# EAGLE design low-energy-meter (EAGLE 7.2.0)
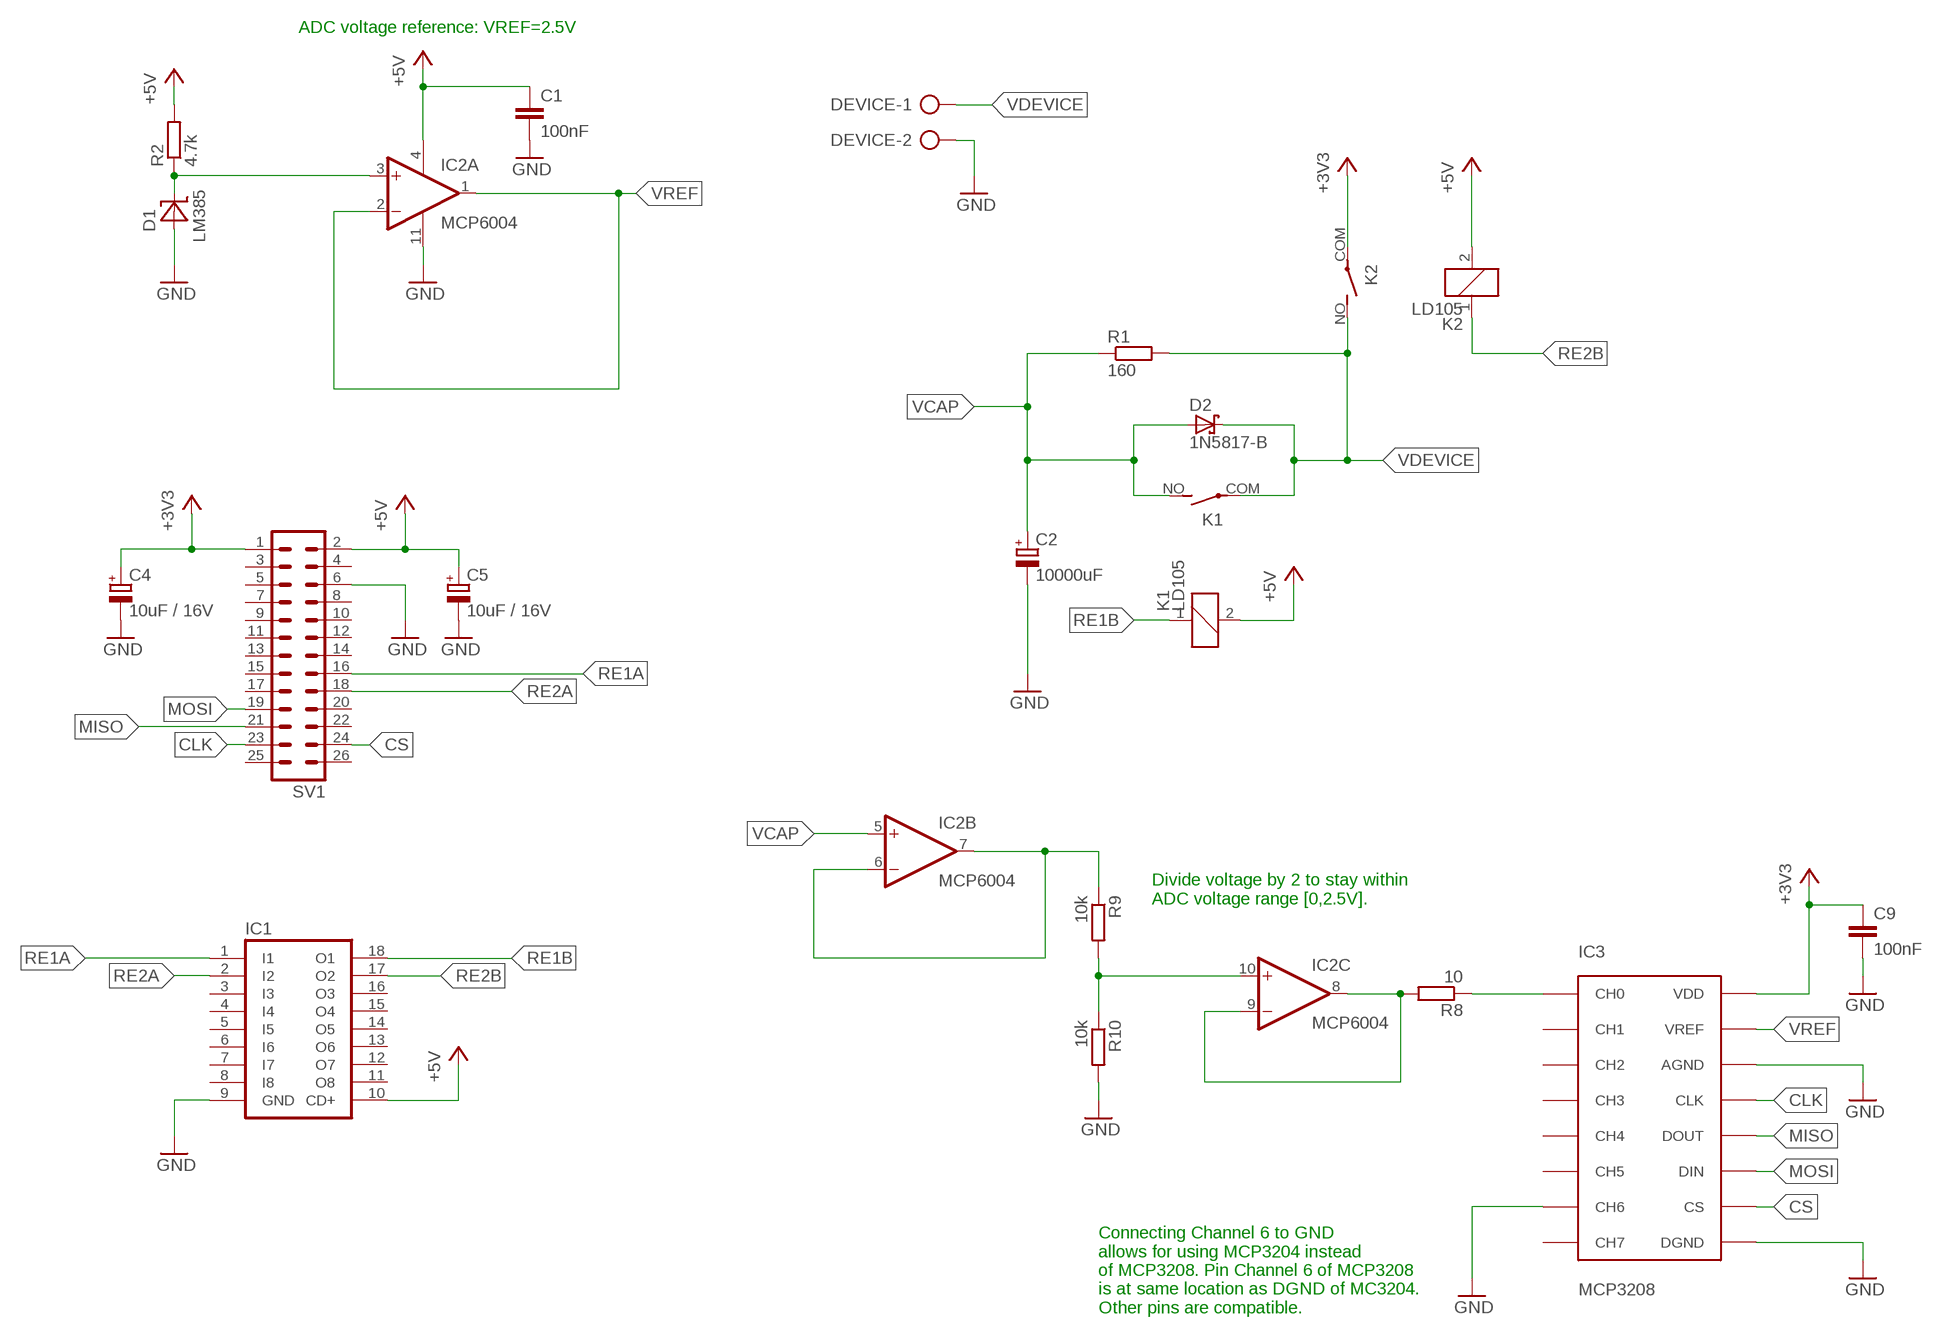
[diagram p0: schematic, sheet 1]

## Parts
C1  100nF  C-EU050-024X044  [C050-024X044]
C2  10000uF  CPOL-EUE7.5-18  [E7,5-18]
C4  10uF / 16V  CPOL-EUE2.5-6  [E2,5-6]
C5  10uF / 16V  CPOL-EUE2.5-6  [E2,5-6]
C9  100nF  C-EU050-024X044  [C050-024X044]
D1  LM385  [TO-92]
D2  1N5817-B  [DO41-7.6]
DEVICE  AK500/2  [AK500/2]
IC1  ULN2803A  [DIL18]
IC2  MCP6004  LM324N  [DIL14]
IC3  MCP3208  [DIL16]
K1  LD105  [LD]
K2  LD105  [LD]
R1  160  R-EU_0207/7  [0207/7]
R2  4.7k  R-EU_0207/7  [0207/7]
R8  10  R-EU_0207/7  [0207/7]
R9  10k  R-EU_0207/7  [0207/7]
R10  10k  R-EU_0207/7  [0207/7]
SV1  ML26  [ML26]

## Nets
+3V3: C4.+ C9.1 IC3.VDD K2.COM(2:P) SV1.1
+5V: C1.1 C5.+ IC1.10(CD+) IC2.4(P:V+) K1.2 K2.2 R2.2 SV1.2
CLK: IC3.CLK SV1.23
CS: IC3.CS SV1.24
GND: C1.2 C2.- C4.- C5.- C9.2 D1.+ DEVICE.2 IC1.9(GND) IC2.11(P:V-) IC3.AGND IC3.CH6 IC3.DGND R10.2 SV1.6
MISO: IC3.DOUT SV1.21
MOSI: IC3.DIN SV1.19
N$1: IC2.6(B:-IN) IC2.7(B:OUT) R9.1
N$9: IC2.10(C:+IN) R9.2 R10.1
N$10: IC3.CH0 R8.1
N$13: IC2.8(C:OUT) IC2.9(C:-IN) R8.2
N$14: D1.- IC2.3(A:+IN) R2.1
RE1A: IC1.1(I1) SV1.16
RE1B: IC1.18(O1) K1.1
RE2A: IC1.2(I2) SV1.18
RE2B: IC1.17(O2) K2.1
VCAP: C2.+ D2.A IC2.5(B:+IN) K1.NO(2:S) R1.1
VDEVICE: D2.C DEVICE.1 K1.COM(2:P) K2.NO(2:S) R1.2
VREF: IC2.1(A:OUT) IC2.2(A:-IN) IC3.VREF
Unconnected: IC1.3(I3) IC1.4(I4) IC1.5(I5) IC1.6(I6) IC1.7(I7) IC1.8(I8) IC1.11(O8) IC1.12(O7) IC1.13(O6) IC1.14(O5) IC1.15(O4) IC1.16(O3) IC2.12(D:+IN) IC2.13(D:-IN) IC2.14(D:OUT) IC3.CH1 IC3.CH2 IC3.CH3 IC3.CH4 IC3.CH5 IC3.CH7 SV1.3 SV1.4 SV1.5 SV1.7 SV1.8 SV1.9 SV1.10 SV1.11 SV1.12 SV1.13 SV1.14 SV1.15 SV1.17 SV1.20 SV1.22 SV1.25 SV1.26

## Notes on the sheet
- ADC voltage reference: VREF=2.5V
- Divide voltage by 2 to stay within
  ADC voltage range [0,2.5V].
- Connecting Channel 6 to GND 
  allows for using MCP3204 instead 
  of MCP3208. Pin Channel 6 of MCP3208 
  is at same location as DGND of MC3204. 
  Other pins are compatible.

## Library data of the parts
C1 C9 = rcl:C-EU: CAPACITOR, European symbol
C2 C4 C5 = rcl:CPOL-EU: POLARIZED CAPACITOR, European symbol
D1 = lm385:LM385: LM385 LM385 Micropower Voltage Reference
D2 = diode:1N581*: 1.0A SCHOTTKY BARRIER RECTIFIER Source: http://www.diodes.com/datasheets/ds23001.pdf
DEVICE = con-ptr500:AK500/2: CONNECTOR; OC_FARNELL: unknown; OC_NEWARK: unknown
IC1 = uln-udn:ULN2803A: DRIVER ARRAY
IC2 = linear:LM324: OP AMP
IC3 = mcp3208:MCP3208
K1 K2 = relay:LD?*: Slim Power Relay NAiS Source: http://www.mew-europe.com/.. en_ds_61112_0000.pdf; OC_FARNELL: 3727154; OC_NEWARK: unknown
R1 R2 R8-R10 = rcl:R-EU_: RESISTOR, European symbol
SV1 = con-harting-ml:ML26: HARTING; OC_FARNELL: unknown; OC_NEWARK: unknown

## Board
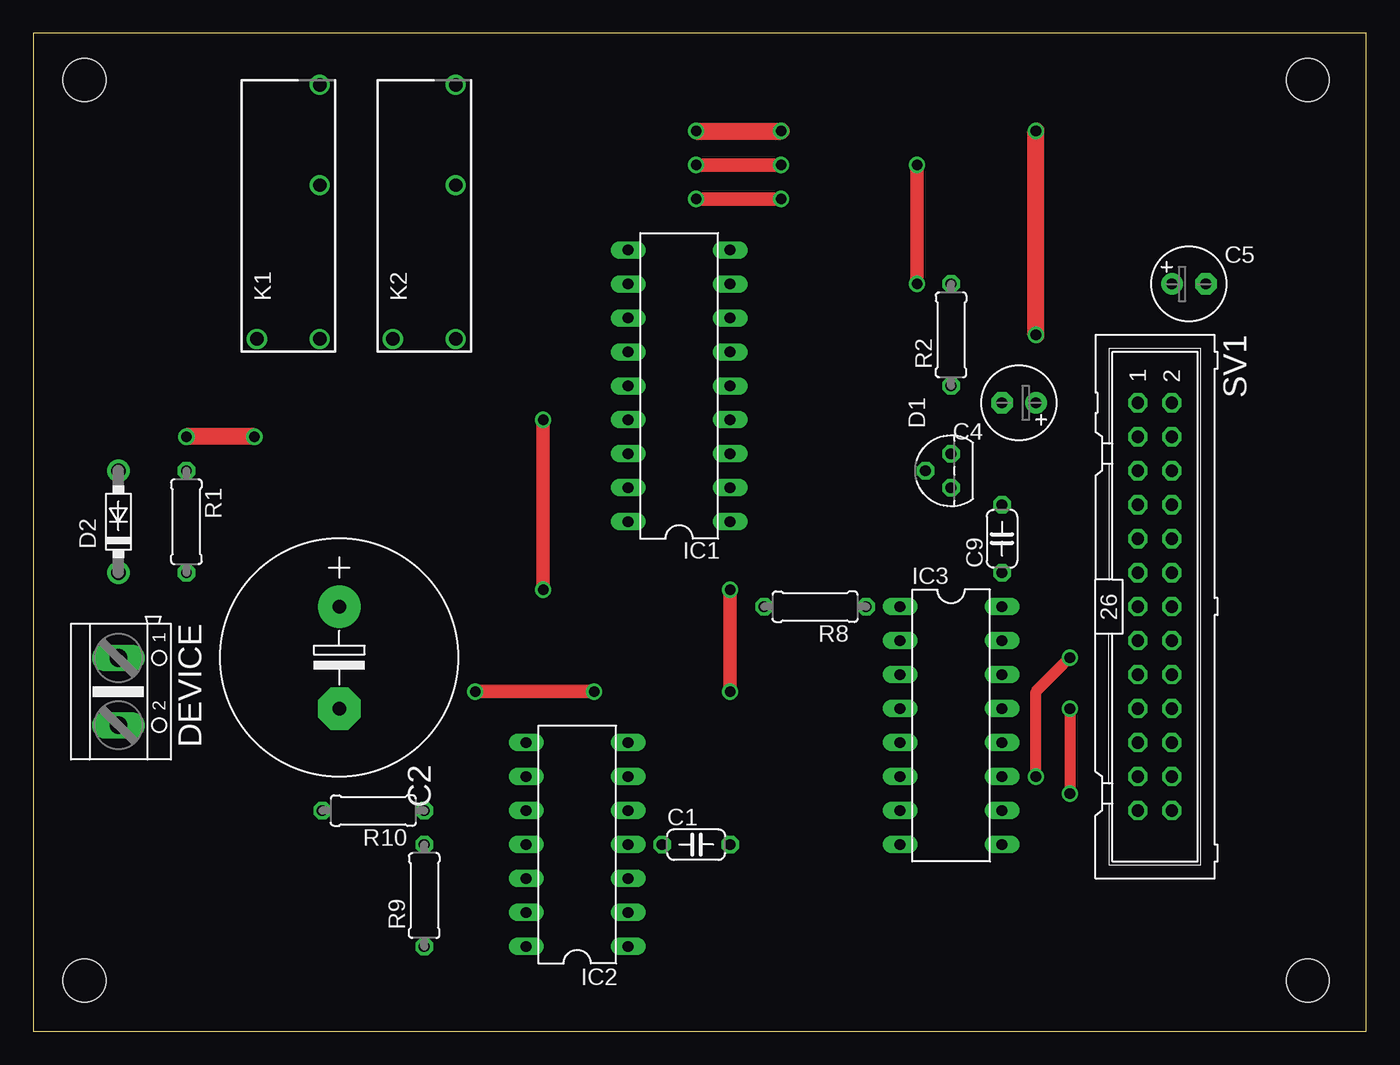
[diagram p1: board, top side]
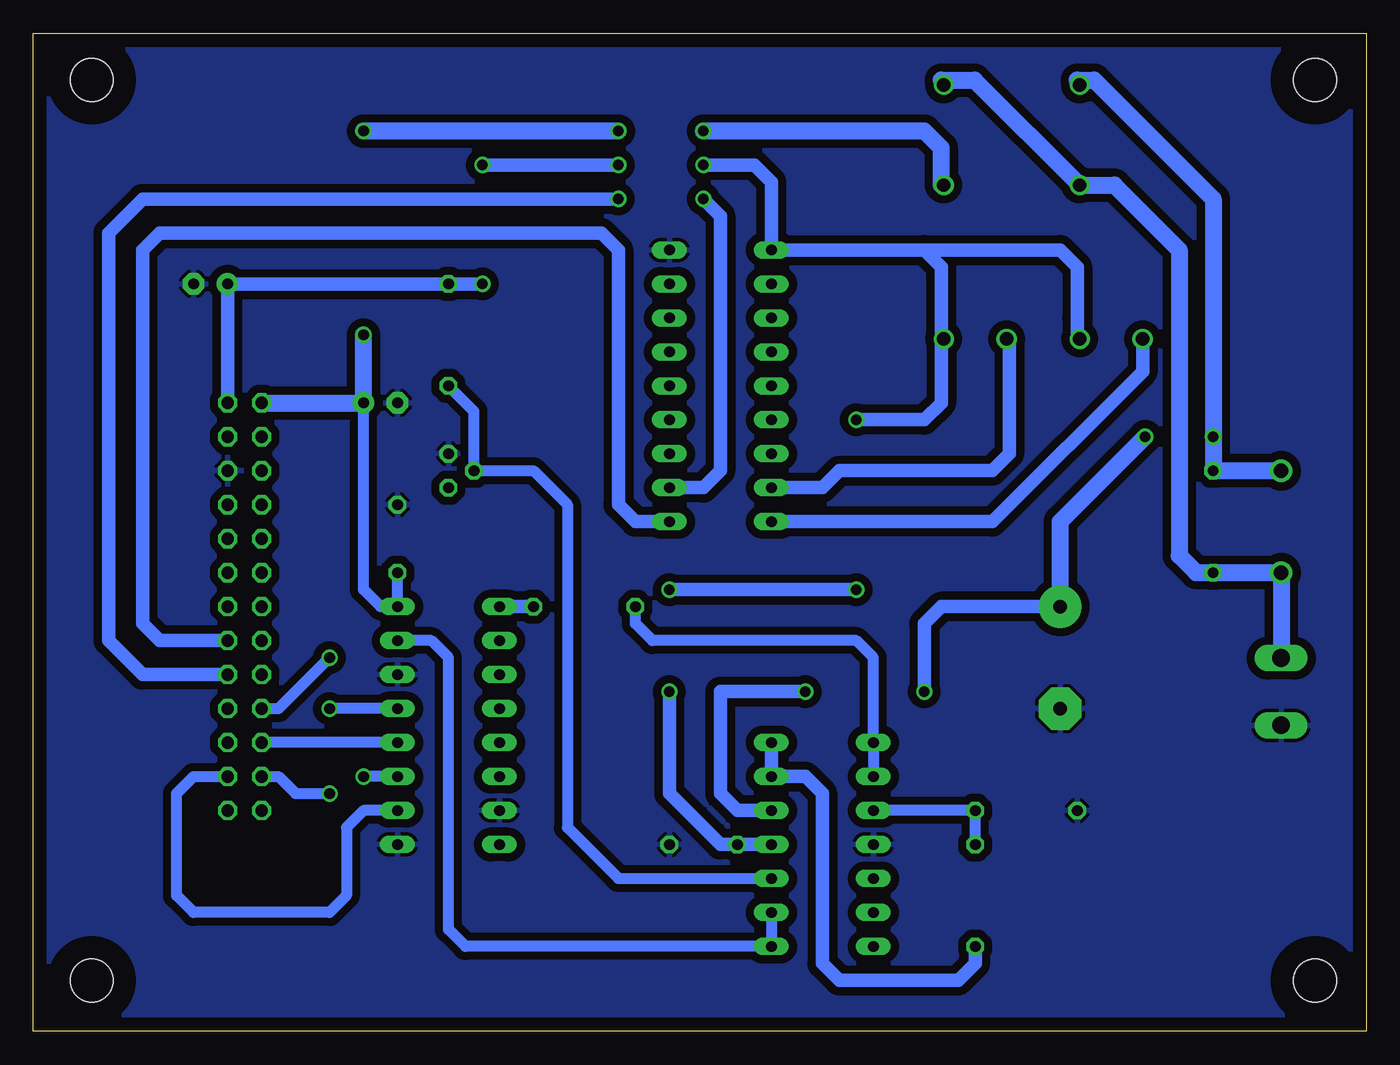
[diagram p2: board, bottom side, seen from below]

Size 99.6 x 74.6 mm. Coordinates in mm from the lower left corner, seen from the top.
Outline: 0,0 99.6,0 99.6,74.6 0,74.6 0,0
Copper layers (1*16): Top 0.035mm / dielectric 1.5mm / Bottom 0.035mm
Design rules "default *": minimum track width 10mil, minimum drill 24mil, track to track 24mil, track to pad 24mil, pad to pad 24mil, via to via 24mil, smd to smd 8mil, copper to edge 40mil, drill to drill 8mil, minimum pad ring 10mil, minimum via ring 8mil, stop-mask expansion 4mil, vias tented up to drill 0mil, thermal gap 10mil
Holes 3.2 mm at 3.81,3.81 3.81,71.12 95.25,3.81 95.25,71.12
bRestrict: area 92,0.5 to 98.5,7.1; area 0.5,0.5 to 7.1,7.1; area 0.5,67.8 to 7.1,74.4; area 92,67.8 to 98.5,74.4

### Footprints (pad centres in the part's own frame; a part is rotated, then mirrored left to right if it is on the bottom)
C050-024X044 = drill 0.813 octagon: 1 -2.54,0; 2 2.54,0
E7,5-18 = drill 1.016 pad 3.15: + -3.81,0 | drill 1.016 pad 3.15 octagon: - 3.81,0
E2,5-6 = drill 0.813 pad 1.6: + -1.27,0 | drill 0.813 pad 1.6 octagon: - 1.27,0
TO-92 = drill 0.813 octagon: + 1.27,0; - 0,1.905; NC -1.27,0
DO41-7.6 = drill 1.1 pad 1.7: A 3.81,0; C -3.81,0
AK500/2 = drill 1.321 long: 1 -2.515,0; 2 2.515,0
DIL18 = drill 0.813 long: 1 -10.16,-3.81; 2 -7.62,-3.81; 3 -5.08,-3.81; 4 -2.54,-3.81; 5 0,-3.81; 6 2.54,-3.81; 7 5.08,-3.81; 8 7.62,-3.81; 9 10.16,-3.81; 10 10.16,3.81; 11 7.62,3.81; 12 5.08,3.81; 13 2.54,3.81; 14 0,3.81; 15 -2.54,3.81; 16 -5.08,3.81; 17 -7.62,3.81; 18 -10.16,3.81
DIL14 = drill 0.813 long: 1 -7.62,-3.81; 2 -5.08,-3.81; 3 -2.54,-3.81; 4 0,-3.81; 5 2.54,-3.81; 6 5.08,-3.81; 7 7.62,-3.81; 8 7.62,3.81; 9 5.08,3.81; 10 2.54,3.81; 11 0,3.81; 12 -2.54,3.81; 13 -5.08,3.81; 14 -7.62,3.81
DIL16 = drill 0.813 long: AGND -3.81,3.81; CH0 -8.89,-3.81; CH1 -6.35,-3.81; CH2 -3.81,-3.81; CH3 -1.27,-3.81; CH4 1.27,-3.81; CH5 3.81,-3.81; CH6 6.35,-3.81; CH7 8.89,-3.81; CLK -1.27,3.81; CS 6.35,3.81; DGND 8.89,3.81; DIN 3.81,3.81; DOUT 1.27,3.81; VDD -8.89,3.81; VREF -6.35,3.81
LD = drill 1: 1 -9.2,2.35; 2 -9.2,-2.35; COM 2.3,-2.35; NO 9.8,-2.35
0207/7 = drill 0.813 octagon: 1 -3.81,0; 2 3.81,0
ML26 = drill 0.914 octagon: 1 -15.24,-1.27; 2 -15.24,1.27; 3 -12.7,-1.27; 4 -12.7,1.27; 5 -10.16,-1.27; 6 -10.16,1.27; 7 -7.62,-1.27; 8 -7.62,1.27; 9 -5.08,-1.27; 10 -5.08,1.27; 11 -2.54,-1.27; 12 -2.54,1.27; 13 0,-1.27; 14 0,1.27; 15 2.54,-1.27; 16 2.54,1.27; 17 5.08,-1.27; 18 5.08,1.27; 19 7.62,-1.27; 20 7.62,1.27; 21 10.16,-1.27; 22 10.16,1.27; 23 12.7,-1.27; 24 12.7,1.27; 25 15.24,-1.27; 26 15.24,1.27

### Placement (x,y rotation side)
C1  49.53,13.97 0 top
C2  22.86,27.94 270 top
C4  73.66,46.99 180 top
C5  86.36,55.88 0 top
C9  72.39,36.83 90 top
D1  68.58,41.91 90 top
D2  6.35,38.1 90 top
DEVICE  6.35,25.4 270 top
IC1  48.26,48.26 90 top
IC2  40.64,13.97 90 top
IC3  68.58,22.86 270 top
K1  19.05,60.96 90 top
K2  29.21,60.96 90 top
R1  11.43,38.1 270 top
R2  68.58,52.07 90 top
R8  58.42,31.75 180 top
R9  29.21,10.16 90 top
R10  25.4,16.51 180 top
SV1  83.82,31.75 270 top

### Tracks (layer width: path | path; a pad name or v marks a point on that pad's centre or on a via)
+3V3  (via drill 0.8)
  Top 1.27: v74.93,52.07 v74.93,67.31 | v49.53,67.31 v55.88,67.31
  Bottom 0.813: C9.1 IC3.VDD 73.66,31.75 74.93,33.02 C4.+
  Bottom 1.016: K2.COM 31.75,63.26
  Bottom 1.27: SV1.1 C4.+ v74.93,52.07 | 31.75,63.26 31.75,66.04 33.02,67.31 v49.53,67.31 | v55.88,67.31 v74.93,67.31
+5V  (via drill 0.8)
  Top 1.016: v66.04,55.88 v66.04,64.77 | v55.88,64.77 v49.53,64.77 | v38.1,33.02 v38.1,45.72 | v52.07,25.4 v52.07,33.02
  Bottom 1.016: SV1.2 C5.+ R2.2 v66.04,55.88 | IC2.4 C1.1 48.26,13.97 52.07,17.78 v52.07,25.4 | v66.04,64.77 v55.88,64.77 | v49.53,64.77 45.72,64.77 44.45,63.5 IC1.10 33.02,58.42 | 33.02,58.42 31.75,57.15 31.75,51.76 | 33.02,58.42 22.86,58.42 21.59,57.15 21.59,53.34 21.59,52.07 21.59,51.76 K1.2 | v38.1,45.72 33.02,45.72 31.75,46.99 31.75,51.76 | v52.07,33.02 v38.1,33.02 | K2.2 31.75,51.76
CLK  (via drill 0.8)
  Top 0.813: v77.47,24.13 v77.47,17.78
  Bottom 0.813: SV1.23 81.28,19.05 80.01,17.78 v77.47,17.78 | IC3.CLK v77.47,24.13
CS
  Bottom 0.813: IC3.CS 74.93,16.51 76.2,15.24 76.2,10.16 77.47,8.89 87.63,8.89 88.9,10.16 88.9,17.78 87.63,19.05 SV1.24
GND
  pour Bottom: -3.81,77.47 102.87,77.47 102.87,-2.54 -3.81,-2.54
MISO
  Bottom 0.813: IC3.DOUT SV1.21
MOSI  (via drill 0.8)
  Top 0.813: v74.93,19.05 74.93,25.4 v77.47,27.94
  Bottom 0.813: IC3.DIN v74.93,19.05 | SV1.19 81.28,24.13 v77.47,27.94
N$1
  Bottom 1.016: IC2.7 IC2.6 41.91,19.05 40.64,17.78 40.64,5.08 39.37,3.81 30.48,3.81 29.21,5.08 R9.1
N$9
  Bottom 0.813: R9.2 R10.1 IC2.10
N$10
  Bottom 1.016: R8.1 IC3.CH0
N$13
  Bottom 0.813: IC2.9 IC2.8 36.83,27.94 38.1,29.21 53.34,29.21 54.61,30.48 R8.2
N$14
  Bottom 0.813: IC2.3 55.88,11.43 59.69,15.24 59.69,39.37 62.23,41.91 D1.- 66.67,46.35 R2.1
RE1A
  Bottom 1.016: SV1.16 90.17,29.21 91.44,30.48 91.44,58.42 90.17,59.69 57.15,59.69 55.88,58.42 55.88,39.37 54.61,38.1 IC1.1
RE1B
  Bottom 1.016: 16.51,51.76 K1.1 16.7,49.34 27.94,38.1 IC1.18
RE2A  (via drill 0.8)
  Top 1.016: v55.88,62.23 v49.53,62.23
  Bottom 1.016: SV1.18 91.44,26.67 93.98,29.21 93.98,59.69 91.44,62.23 v55.88,62.23 | v49.53,62.23 48.26,60.96 48.26,41.91 49.53,40.64 IC1.2
RE2B
  Bottom 1.016: IC1.17 40.64,40.64 39.37,41.91 27.94,41.91 26.67,43.18 26.67,51.76 K2.1
VCAP  (via drill 0.8)
  Top 1.016: v33.02,25.4 v41.91,25.4
  Top 1.27: v16.51,44.45 v11.43,44.45
  Bottom 1.016: IC2.5 46.99,16.51 48.26,17.78 48.26,25.4 v41.91,25.4 | C2.+ 31.75,31.75 33.02,30.48 v33.02,25.4 | K1.NO 21.4,70.93 21.59,71.12
  Bottom 1.27: 21.59,71.12 20.32,71.12 11.43,62.23 v11.43,44.45 R1.1 D2.A | C2.+ 22.86,38.1 v16.51,44.45
VDEVICE
  Bottom 1.016: K2.NO 31.56,70.93 31.75,71.12
  Bottom 1.27: 31.75,71.12 29.26,71.12 K1.COM 18.81,63.26 13.97,58.42 13.97,35.56 12.7,34.29 R1.2 D2.C DEVICE.1
VREF
  Bottom 0.813: IC2.2 IC2.1 67.31,6.35 68.58,7.62 68.58,27.94 69.85,29.21 IC3.VREF